# Altium schematic sheet selector.SchDoc
size A4
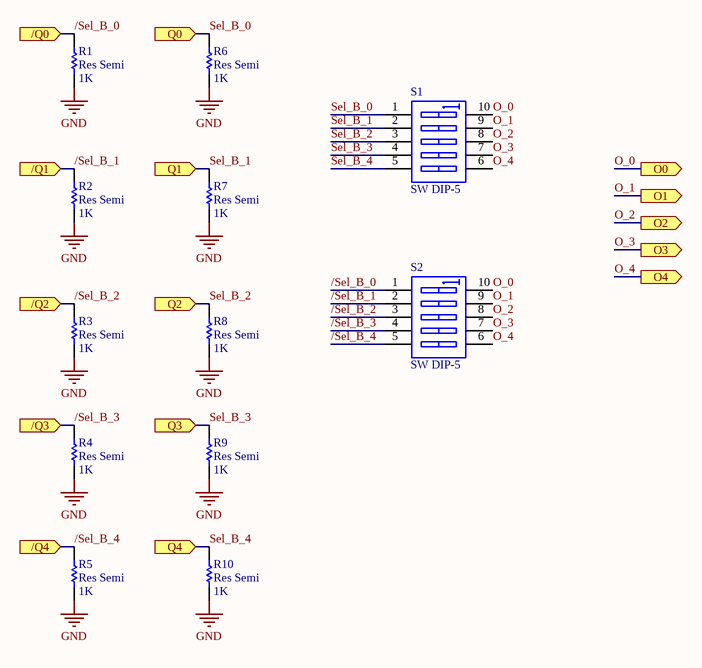
[diagram p0: selector.SchDoc]

## Parts
R1  Res Semi  value 1K  [2012[0805]]
R2  Res Semi  value 1K  [2012[0805]]
R3  Res Semi  value 1K  [2012[0805]]
R4  Res Semi  value 1K  [2012[0805]]
R5  Res Semi  value 1K  [2012[0805]]
R6  Res Semi  value 1K  [2012[0805]]
R7  Res Semi  value 1K  [2012[0805]]
R8  Res Semi  value 1K  [2012[0805]]
R9  Res Semi  value 1K  [2012[0805]]
R10  Res Semi  value 1K  [2012[0805]]
S1  SW DIP-5  [N10A]
S2  SW DIP-5  [N10A]

## Ports
/Q0 (in), /Q1 (in), /Q2 (in), /Q3 (in), /Q4 (in), O0 (out), O1 (out), O2 (out), O3 (out), O4 (out), Q0 (in), Q1 (in), Q2 (in), Q3 (in), Q4 (in)

## Nets
GND: R1.1 R2.1 R3.1 R4.1 R5.1 R6.1 R7.1 R8.1 R9.1 R10.1
/Sel_B_0: R1.2 S2.1(A1) ; port /Q0
/Sel_B_1: R2.2 S2.2(A2) ; port /Q1
/Sel_B_2: R3.2 S2.3(A3) ; port /Q2
/Sel_B_3: R4.2 S2.4(A4) ; port /Q3
/Sel_B_4: R5.2 S2.5(A5) ; port /Q4
O_0: S1.10(B1) S2.10(B1) ; port O0
O_1: S1.9(B2) S2.9(B2) ; port O1
O_2: S1.8(B3) S2.8(B3) ; port O2
O_3: S1.7(B4) S2.7(B4) ; port O3
O_4: S1.6(B5) S2.6(B5) ; port O4
Sel_B_0: R6.2 S1.1(A1) ; port Q0
Sel_B_1: R7.2 S1.2(A2) ; port Q1
Sel_B_2: R8.2 S1.3(A3) ; port Q2
Sel_B_3: R9.2 S1.4(A4) ; port Q3
Sel_B_4: R10.2 S1.5(A5) ; port Q4

## Library data of the parts
R1-R10 = Res Semi: Semiconductor Resistor; Published: 8-Jun-2000; LatestRevisionDate: 17-Jul-2002; LatestRevisionNote: Re-released for DXP Platform.; PackageReference: AXIAL-0.5; Publisher: Altium Limited
S1 S2 = SW DIP-5: DIP Switch, 5 Position, SPST; Published: 24-Mar-1999; LatestRevisionDate: 17-Jul-2002; LatestRevisionNote: Re-released for DXP Platform.; PackageReference: N10A; Publisher: Altium Limited